# Altium schematic sheet EMT- Exciting Source.SchDoc
size A4
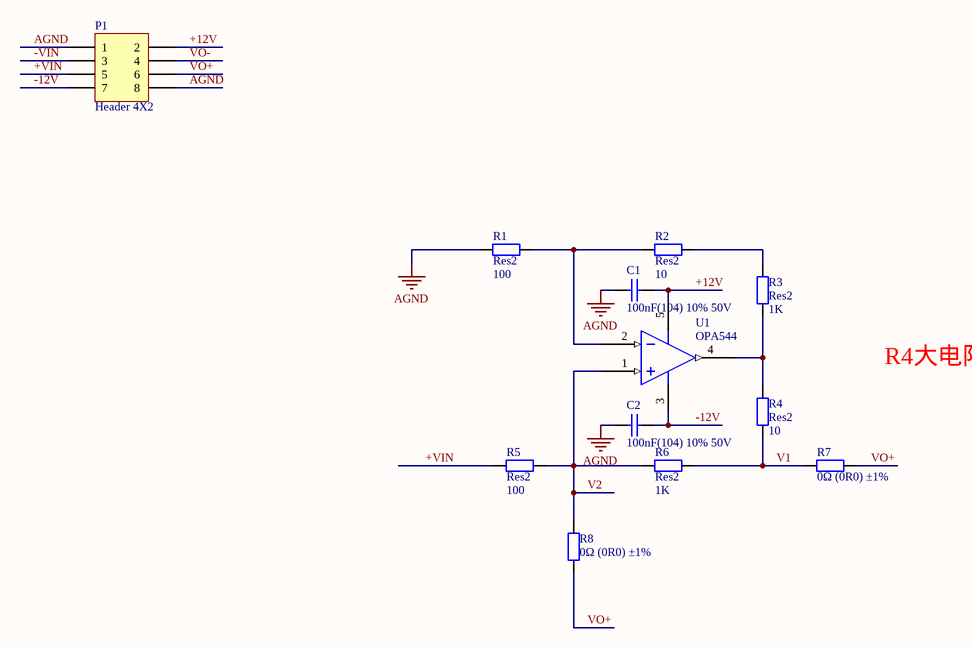
[diagram p0: EMT- Exciting Source.SchDoc]

## Parts
C1  100nF(104) 10% 50V  [LC-0805_C]
C2  100nF(104) 10% 50V  [LC-0805_C]
P1  Header 4X2  [HDR2X4]
R1  Res2  value 100  [AXIAL-0.4]
R2  Res2  value 10  [AXIAL-0.4]
R3  Res2  value 1K  [AXIAL-0.4]
R4  Res2  value 10  [AXIAL-0.4]
R5  Res2  value 100  [AXIAL-0.4]
R6  Res2  value 1K  [AXIAL-0.4]
R7  0Ω (0R0) ±1%  [LC-0805_R]
R8  0Ω (0R0) ±1%  [LC-0805_R]
U1  OPA544  [TO-220-5]

## Nets
AGND: C1.1 C2.1 P1.1 P1.8 R1.1
+12V: C1.2 P1.2 U1.5(+VS)
+VIN: P1.5 R5.1
-12V: C2.2 P1.7 U1.3(-VS)
-VIN: P1.3
V1: R4.1 R6.2 R7.1
V2: R5.2 R6.1 R8.2 U1.1(+)
VO+: P1.6 R7.2 R8.1
VO-: P1.4
NetR1_2: R1.2 R2.1 U1.2(-)
NetR2_2: R2.2 R3.2
NetR3_1: R3.1 R4.2 U1.4(VO)

## Notes on the sheet
- R4大电阻

## Library data of the parts
C1 C2 = 0805 100nF(104) 10% 50V: 贴片电容; ComponentLink1Description: 供应商链接; ComponentLink1URL: http://www.szlcsc.com/product/details_50686.html; Package: 0805; Supplier: LC; SuppliersPartNumber: C49678
P1 = Header 4X2: Header, 4-Pin, Dual row; LatestRevisionDate: 17-Jul-2002; LatestRevisionNote: Re-released for DXP Platform.; Publisher: Altium Limited
R1-R6 = Res2: Resistor; Published: 8-Jun-2000; LatestRevisionDate: 17-Jul-2002; LatestRevisionNote: Re-released for DXP Platform.; PackageReference: AXIAL-0.4; Publisher: Altium Limited; PackageDescription: Axial Device, Thru-Hole; 2 Leads; 0.4 in Pin Spacing
R7 R8 = 0805 0Ω (0R0) 1%: 贴片电阻; ComponentLink1Description: 供应商链接; ComponentLink1URL: http://www.szlcsc.com/product/details_18165.html; Package: 0805; Supplier: LC; SuppliersPartNumber: C17477
U1 = OPA544: Imported; Manufacturer: Texas Instruments; Manufacturer_Part_Number: opa544_ktt_5; INDUSTRY_STD_PKG_TYPE: DDPAK/TO-263; FAMILY_NAME: HIGH OUTPUT CURRENT; PIN_COUNT: 5; PACKAGE_DESIGNATOR: KTT; Datasheet_URL: http://www.ti.com/lit/gpn/OPA544; GENERIC_PART_NUMBER: OPA544; Vendor: Texas Instruments; Value: Value; Type: Type; RefDes: RefDes